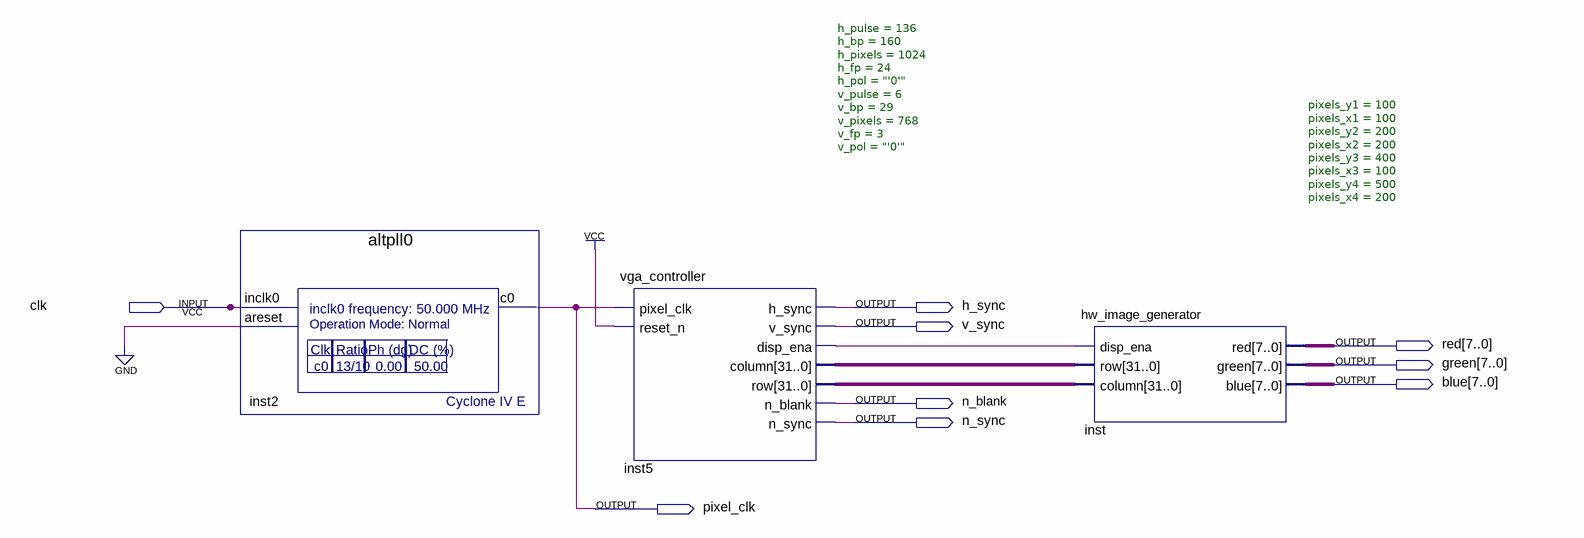
[diagram p0: schematic sheet]
// Quartus schematic vga_with_hw_test_image.bdf as structural Verilog: 3 symbols, 9 pins
module vga_with_hw_test_image (
  input  clk,
  output h_sync,
  output v_sync,
  output [7:0] red,
  output [7:0] green,
  output [7:0] blue,
  output n_blank,
  output n_sync,
  output pixel_clk
);

  wire inst5_disp_ena;
  wire [31:0] inst5_column, inst5_row;

  altpll0 inst2 (.inclk0(clk), .areset(1'b0), .c0(pixel_clk));
  vga_controller #(.h_pulse(136), .h_bp(160), .h_pixels(1024), .h_fp(24), .h_pol("'0'"), .v_pulse(6), .v_bp(29), .v_pixels(768), .v_fp(3), .v_pol("'0'")) inst5 (
    .pixel_clk(pixel_clk), .reset_n(1'b1), .h_sync(h_sync), .v_sync(v_sync), .disp_ena(inst5_disp_ena),
    .column(inst5_column), .row(inst5_row), .n_blank(n_blank), .n_sync(n_sync));
  hw_image_generator #(.pixels_y1(100), .pixels_x1(100), .pixels_y2(200), .pixels_x2(200), .pixels_y3(400), .pixels_x3(100), .pixels_y4(500), .pixels_x4(200)) inst (
    .disp_ena(inst5_disp_ena), .row(inst5_column), .column(inst5_row), .red(red), .green(green), .blue(blue));
endmodule
